# Altium schematic sheet HighSideDriver.SchDoc
size A
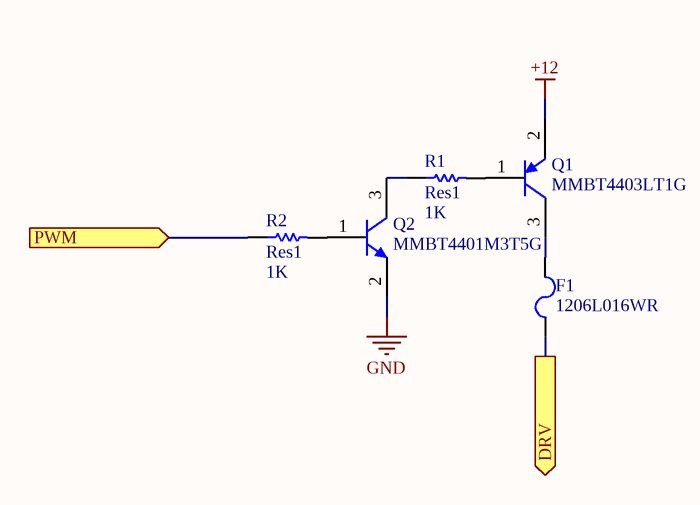
[diagram p0: HighSideDriver.SchDoc]

## Parts
F1  1206L016WR  [LFUS-1206L016WR_V]
Q1  MMBT4403LT1G  [ONSC-SOT-23-3-318-08_V]
Q2  MMBT4401M3T5G  [ONSC-SOT-23-3-318-08_V]
R1  Res1  value 1K  [J1-0603]
R2  Res1  value 1K  [J1-0603]

## Ports
DRV (out), PWM (in)

## Nets
+12: Q1.2(E)
GND: Q2.2(E)
DRV: F1.1 ; port DRV
PWM: R2.1 ; port PWM
NetF1_2: F1.2 Q1.3(C)
NetQ1_1: Q1.1(B) R1.2
NetQ2_1: Q2.1(B) R2.2
NetQ2_3: Q2.3(C) R1.1

## Library data of the parts
F1 = CMP-2000-05471-1: Resettable Fuse, 30 V, 100 A, 4.5 Ohm, -40 to 85 degC, 1206 (3216 Metric), RoHS, Tape and Reel; Manufacturer: Littelfuse; Hold Current [Ih]: 0.16A; Trip Current: 0.37A; Working Voltage-Max: 30V; Datasheet Version: 08/2016; Size: 1206; Manufacturer URL: http://www.littelfuse.com/; Datasheet URL: http://www.littelfuse.com/~/media/electronics/datasheets/resettable_ptcs/littelfuse_ptc_1206l_datasheet.pdf.pdf; Mounting Technology: SurfaceMount; Package Reference: 1206L016WR; Package Description: 2-Pin Surface Mount Device, Body 3.2 x 1.65 mm, Height 1.45 mm (Max); Operating Temp Range: -40to+85°C
Q1 = CMP-1048-00539-1: Switching Transistor, PNP Silicon, 3-Pin SOT-23, Pb-Free, Tape and Reel; Manufacturer: On Semiconductor; fT Min (MHz): 200; IC Continuous (A): -0.6; ComponentLink1URL: http://www.onsemi.com/; ComponentLink2URL: http://www.onsemi.cn/pub_link/Collateral/MMBT4403LT1-D.PDF; PackageVersion: Rev. AP, 11/2009; ComponentLink1Description: Manufacturer URL; PackageDescription: 3-Pin Small Outline Transistor, Body 2.92 x 1.3 mm, Pitch 0.95 mm; Polarity: PNP; ComponentLink3Description: Package Specification; DatasheetVersion: Rev. 12; Mounting Technology: Surface Mount; PackageReference: SOT-23-3-318-08; ComponentLink3URL: http://www.onsemi.cn/pub_link/Collateral/318-08.PDF; Packing: Tape and Reel; PartNumber: MMBT4403LT1G; RoHS: TRUE; ComponentLink2Description: Datasheet
Q2 = CMP-1048-00548-1: Switching Transistor, NPN Silicon, 3-Pin SOT-23, Pb-Free, Tape and Reel; Manufacturer: On Semiconductor; PartNumber: MMBT4401LT3G; fT Min (MHz): 250; IC Continuous (A): 0.6; PackageReference: SOT-23-3-318-08; ComponentLink2Description: Datasheet; DatasheetVersion: Rev. 10; ComponentLink3Description: Package Specification; RoHS: TRUE; Packing: Tape and Reel; ComponentLink1Description: Manufacturer URL; ComponentLink1URL: http://www.onsemi.com/; Mounting Technology: Surface Mount; ComponentLink2URL: http://www.onsemi.cn/pub_link/Collateral/MMBT4401LT1-D.PDF; ComponentLink3URL: http://www.onsemi.cn/pub_link/Collateral/318-08.PDF; PackageVersion: Rev. AP, 11/2009; PackageDescription: 3-Pin Small Outline Transistor, Body 2.92 x 1.3 mm, Pitch 0.95 mm; Polarity: NPN
R1 R2 = Res1: Resistor; Published: 8-Jun-2000; LatestRevisionDate: 17-Jul-2002; LatestRevisionNote: Re-released for DXP Platform.; PackageReference: AXIAL-0.3; Publisher: Altium Limited; PackageDescription: Axial Device, Thru-Hole; 2 Leads; 0.3 in Pin Spacing